# Altium project PCB_Project.PrjPcb
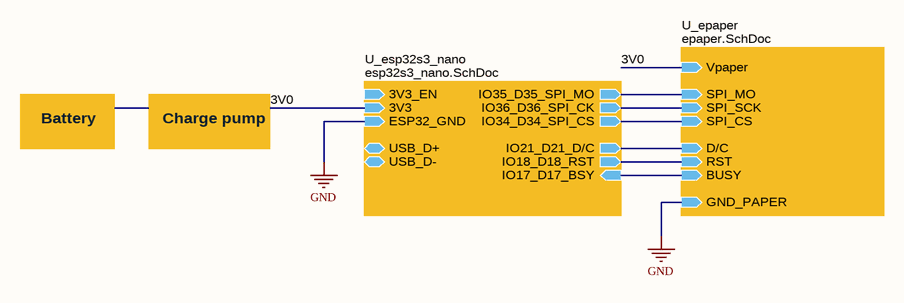
[diagram p0: Page_turner_top.SchDoc]
3 sheets, 12 parts. Net scope: hierarchical (ports join the sheet entries above them; power ports are global).
Board file: page_turner.PcbDoc
Sheets:
  Page_turner_top.SchDoc
    U_epaper = epaper.SchDoc
    U_esp32s3_nano = esp32s3_nano.SchDoc

## Sheet Page_turner_top.SchDoc
size Letter; SheetNumber: 1; SheetTotal: 3

### Sub-sheets
U_epaper = epaper.SchDoc: Vpaper (in), SPI_MO (in), SPI_SCK (in), SPI_CS (in), GND_PAPER (in), D/C (in), RST (in), BUSY (in)
U_esp32s3_nano = esp32s3_nano.SchDoc: IO35_D35_SPI_MO (out), IO36_D36_SPI_CK (out), IO34_D34_SPI_CS (out), 3V3 (in), USB_D+ (bidir), USB_D- (bidir), 3V3_EN (in), IO21_D21_D/C (out), IO18_D18_RST (out), IO17_D17_BSY (in), ESP32_GND (in)

### Nets
GND: sheet U_epaper/GND_PAPER, sheet U_esp32s3_nano/ESP32_GND
3V0: sheet U_epaper/Vpaper, sheet U_esp32s3_nano/3V3
NetU5000_10: sheet U_epaper/RST, sheet U_esp32s3_nano/IO18_D18_RST
NetU5000_11: sheet U_epaper/D/C, sheet U_esp32s3_nano/IO21_D21_D/C
NetU5000_12: sheet U_epaper/BUSY, sheet U_esp32s3_nano/IO17_D17_BSY
NetU5000_23: sheet U_epaper/SPI_MO, sheet U_esp32s3_nano/IO35_D35_SPI_MO
NetU5000_25: sheet U_epaper/SPI_SCK, sheet U_esp32s3_nano/IO36_D36_SPI_CK
NetU5000_26: sheet U_epaper/SPI_CS, sheet U_esp32s3_nano/IO34_D34_SPI_CS

### Notes on the sheet
- Battery
- Charge pump

## Sheet epaper.SchDoc
size A; SheetNumber: 2; SheetTotal: 3
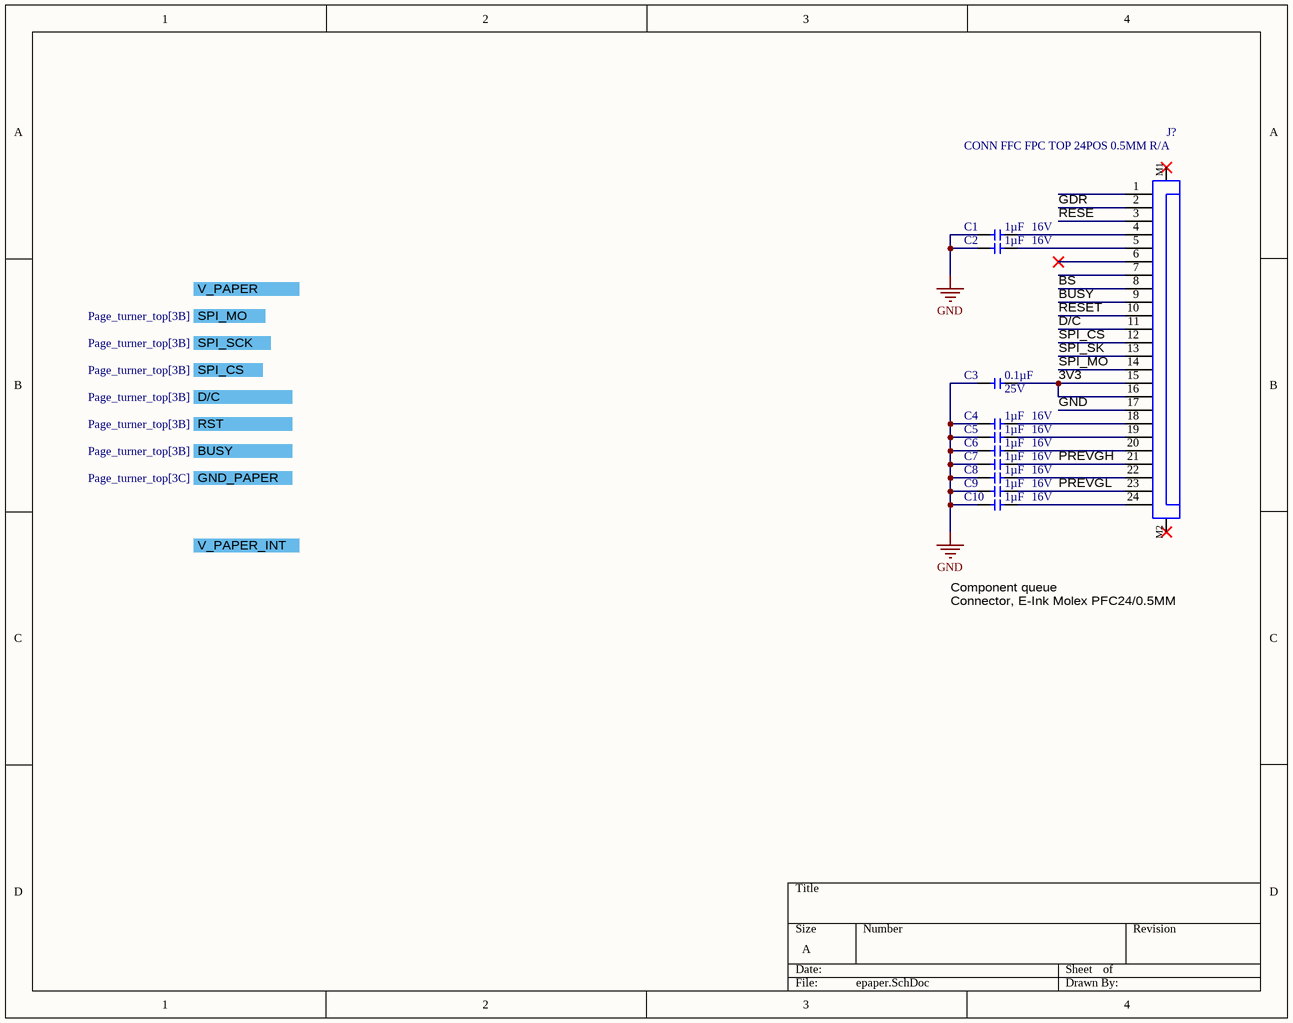
[diagram p1: epaper.SchDoc]

### Parts
C1  value 1µF  Voltage: 16V  [CAPC_0402_L1W0.5H0.5]  (hidden comment: CAP CER 1UF 16V X6S 0402)
C2  value 1µF  Voltage: 16V  [CAPC_0402_L1W0.5H0.5]  (hidden comment: CAP CER 1UF 16V X6S 0402)
C3  value 0.1µF  Voltage: 25V  [CAPC_0402_L1W0.5H0.5]  (hidden comment: CAP CER 0.1UF 25V X7R 0402)
C4  value 1µF  Voltage: 16V  [CAPC_0402_L1W0.5H0.5]  (hidden comment: CAP CER 1UF 16V X6S 0402)
C5  value 1µF  Voltage: 16V  [CAPC_0402_L1W0.5H0.5]  (hidden comment: CAP CER 1UF 16V X6S 0402)
C6  value 1µF  Voltage: 16V  [CAPC_0402_L1W0.5H0.5]  (hidden comment: CAP CER 1UF 16V X6S 0402)
C7  value 1µF  Voltage: 16V  [CAPC_0402_L1W0.5H0.5]  (hidden comment: CAP CER 1UF 16V X6S 0402)
C8  value 1µF  Voltage: 16V  [CAPC_0402_L1W0.5H0.5]  (hidden comment: CAP CER 1UF 16V X6S 0402)
C9  value 1µF  Voltage: 16V  [CAPC_0402_L1W0.5H0.5]  (hidden comment: CAP CER 1UF 16V X6S 0402)
C10  value 1µF  Voltage: 16V  [CAPC_0402_L1W0.5H0.5]  (hidden comment: CAP CER 1UF 16V X6S 0402)
J?  CONN FFC FPC TOP 24POS 0.5MM R/A  [F32Q-1A7H1-11024]

### Ports
BUSY (see Page_turner_top[3B]), D/C (see Page_turner_top[3B]), GND_PAPER (see Page_turner_top[3C]), RST (see Page_turner_top[3B]), SPI_CS (see Page_turner_top[3B]), SPI_MO (see Page_turner_top[3B]), SPI_SCK (see Page_turner_top[3B]), V_PAPER, V_PAPER_INT

### Nets
GND: C1.1 C2.1 C3.1 C4.1 C5.1 C6.1 C7.1 C8.1 C9.1 C10.1 J?.17 ; port GND_PAPER
3V3: C3.2 J?.15 J?.16
BS: J?.8
BUSY: J?.9
D/C: J?.11
GDR: J?.2
PREVGH: C7.2 J?.21
PREVGL: C9.2 J?.23
RESE: J?.3
RESET: J?.10
SPI_CS: J?.12
SPI_MO: J?.14
SPI_SK: J?.13
NetC1_2: C1.2 J?.4
NetC2_2: C2.2 J?.5
NetC4_2: C4.2 J?.18
NetC5_2: C5.2 J?.19
NetC6_2: C6.2 J?.20
NetC8_2: C8.2 J?.22
NetC10_2: C10.2 J?.24

Not connected (* = marked no-connect by the designer): J? 1 6* 7 M1* M2*

### Notes on the sheet
- Component queue
  Connector, E-Ink Molex PFC24/0.5MM

### Library data of the parts
C1 C2 C4-C10 = CER1.0UF16V0402X6S: 1 µF ±10% 16V Ceramic Capacitor X6S 0402 (1005 Metric); Manufacturer Part Number 1: GRM155C81C105KE15J; Manufacturer 1: Murata Electronics; Tolerance: ±10%; Operating Temperature: -55°C ~ 105°C; Package: 0402 (1005 Metric); Type: Ceramic
C3 = CER0.1UF25V0402X7R: 0.1 µF ±10% 25V Ceramic Capacitor X7R 0402 (1005 Metric); Manufacturer Part Number 1: GRM155R71E104KE14J; Manufacturer 1: Murata Electronics; Tolerance: ±10%; Operating Temperature: -55°C ~ 125°C; Package: 0402 (1005 Metric); Type: Ceramic
J? = F32Q-1A7H1-11024: 24 Position FFC, FPC Connector Contacts, Top 0.020" (0.50mm) Surface Mount, Right Angle; Manufacturer 1: Amphenol ICC (FCI); Voltage Rating: 50V; Current Rating: 0.5A; Number of Positions: 24; Notes: Slide Lock; Operating Temperature: -40°C ~ 105°C; Contact Finish: Gold; Manufacturer Part Number 1: F32Q-1A7H1-11024; Pitch: 0.020" (0.50mm); Series: Aorora F32Q

## Sheet esp32s3_nano.SchDoc
size Letter; SheetNumber: 3; SheetTotal: 3
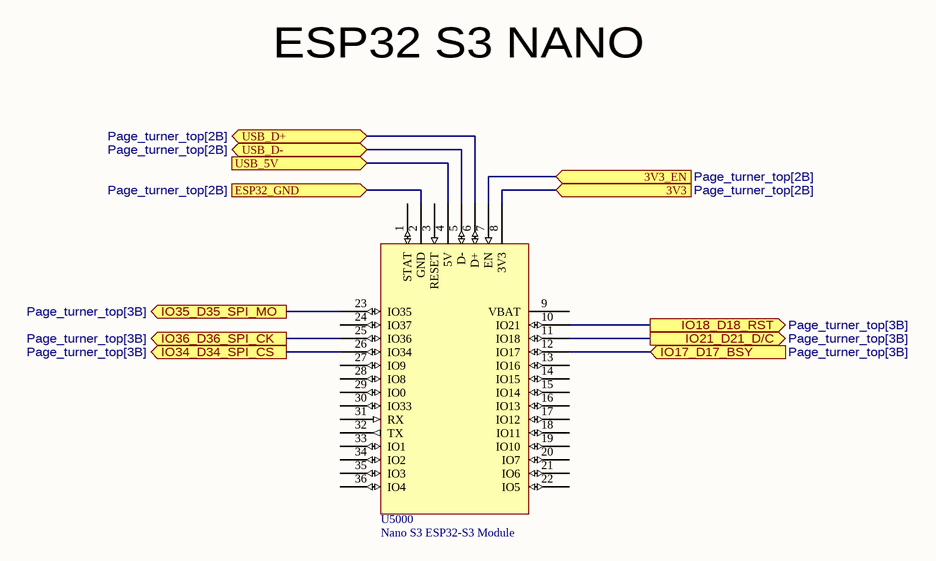
[diagram p2: esp32s3_nano.SchDoc]

### Parts
U5000  Nano S3 ESP32-S3 Module  [NanoS3]

### Ports
3V3 (in, see Page_turner_top[2B]), 3V3_EN (in, see Page_turner_top[2B]), ESP32_GND (in, see Page_turner_top[2B]), IO17_D17_BSY (in, see Page_turner_top[3B]), IO18_D18_RST (out, see Page_turner_top[3B]), IO21_D21_D/C (out, see Page_turner_top[3B]), IO34_D34_SPI_CS (out, see Page_turner_top[3B]), IO35_D35_SPI_MO (out, see Page_turner_top[3B]), IO36_D36_SPI_CK (out, see Page_turner_top[3B]), USB_5V (in), USB_D+ (bidir, see Page_turner_top[2B]), USB_D- (bidir, see Page_turner_top[2B])

### Nets
GND: U5000.2(GND) ; port ESP32_GND
3V0: U5000.8(3V3) ; port 3V3
NetU5000_4: U5000.4(5V) ; port USB_5V
NetU5000_5: U5000.5(D-) ; port USB_D-
NetU5000_6: U5000.6(D+) ; port USB_D+
NetU5000_7: U5000.7(EN) ; port 3V3_EN
NetU5000_10: U5000.10(IO21) ; port IO18_D18_RST
NetU5000_11: U5000.11(IO18) ; port IO21_D21_D/C
NetU5000_12: U5000.12(IO17) ; port IO17_D17_BSY
NetU5000_23: U5000.23(IO35) ; port IO35_D35_SPI_MO
NetU5000_25: U5000.25(IO36) ; port IO36_D36_SPI_CK
NetU5000_26: U5000.26(IO34) ; port IO34_D34_SPI_CS

Not connected (* = marked no-connect by the designer): U5000 1(STAT) 3(RESET) 9(VBAT) 13(IO16) 14(IO15) 15(IO14) 16(IO13) 17(IO12) 18(IO11) 19(IO10) 20(IO7) 21(IO6) 22(IO5) 24(IO37) 27(IO9) 28(IO8) 29(IO0) 30(IO33) 31(RX) 32(TX) 33(IO1) 34(IO2) 35(IO3) 36(IO4)

### Notes on the sheet
- ESP32 S3 NANO

### Library data of the parts
U5000 = NanoS3: Manufacturer 1: Unexpected Maker; Manufacturer Part Number 1: *

## Nets that join several sheets
GND: epaper (11 pins), esp32s3_nano (U5000.2)